# Altium schematic sheet Stage2Sensors.SchDoc
size A
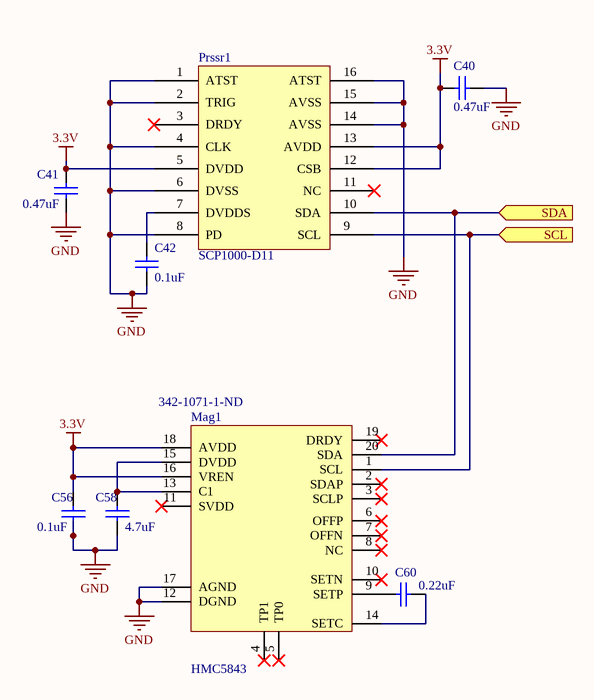
[diagram p0: Stage2Sensors.SchDoc]

## Parts
C40  value 0.47uF  [0603_CAP]  (hidden comment: X7R Cap)
C41  value 0.47uF  [0603_CAP]  (hidden comment: X7R Cap)
C42  value 0.1uF  [0603_CAP]  (hidden comment: X7R Cap)
C56  value 0.1uF  [0603_CAP]  (hidden comment: X7R Cap)
C58  value 4.7uF  [0603_CAP]  (hidden comment: X7R Cap)
C60  value 0.22uF  [0603_CAP]  (hidden comment: X7R Cap)
Mag1  HMC5843  Supplier Part Number 2: 342-1071-1-ND  [HMC5843]
Prssr1  SCP1000-D11  [SCP1000-D11]

## Ports
SCL (in), SDA (in)

## Nets
3.3V: C40.2 C41.2 C56.2 Mag1.16(VREN) Mag1.18(AVDD) Prssr1.5(DVDD) Prssr1.12(CSB) Prssr1.13(AVDD)
GND: C40.1 C41.1 C42.2 C56.1 C58.1 Mag1.12(DGND) Mag1.17(AGND) Prssr1.1(ATST) Prssr1.2(TRIG) Prssr1.4(CLK) Prssr1.6(DVSS) Prssr1.8(PD) Prssr1.14(AVSS) Prssr1.15(AVSS) Prssr1.16(ATST)
SCL: Mag1.1(SCL) Prssr1.9(SCL) ; port SCL
SDA: Mag1.20(SDA) Prssr1.10(SDA) ; port SDA
NetC42_1: C42.1 Prssr1.7(DVDDS)
NetC58_2: C58.2 Mag1.13(C1) Mag1.15(DVDD)
NetC60_1: C60.1 Mag1.14(SETC)
NetC60_2: C60.2 Mag1.9(SETP)

Not connected (* = marked no-connect by the designer): Mag1 2(SDAP)* 3(SCLP)* 4(TP1)* 5(TP0)* 6(OFFP)* 7(OFFN)* 8(NC)* 10(SETN)* 11(SVDD)* 19(DRDY)*; Prssr1 3(DRDY)* 11(NC)*

## Library data of the parts
C40-C42 C56 C58 C60 = Cap: Capacitor; Published: 8-Jun-2000; LatestRevisionDate: 17-Jul-2002; LatestRevisionNote: Re-released for DXP Platform.; PackageReference: RAD-0.3; Publisher: Altium Limited
Mag1 = Magnetometer HMC5843: Manufacturer: Honeywell Microelectronics & Precision Sensors; Manufacturer Part Number: HMC5843-TR; Description: SENSOR MAGNETIC 3 AXIS 20-LCC; Sensing Range: ±4g; Voltage - Supply: 2.5 V ~ 3.3 V; Current - Supply: 80µA; Output Type: Differential Voltage; Supplier 1: Sparkfun; Supplier Part Number 1: COM-09441; Supplier 2: Digi-Key; RoHS: RoHS Compliant; Category: Sensors, Transducers; Stock 2: 0; Type: Compass - Three Axis; Current - Output (Max): -; Features: Compass - Three Axis; Operating Temperature: -30°C ~ 80°C; Package / Case: 20-LCC; Supplier Device Package: 20-LCC; Packaging: Cut Tape (CT); ComponentLink1URL: http://www51.honeywell.com/aero/common/documents/myaerospacecatalog-documents/Defense_Brochures-documents/HMC5843.pdf; ComponentLink1Description: http://www51.honeywell.com/aero/common/documents/myaerospacecatalog-documents/Defense_Brochures-documents/HMC5843.pdf